# Altium project PanQuanXingProbj.PrjPCB
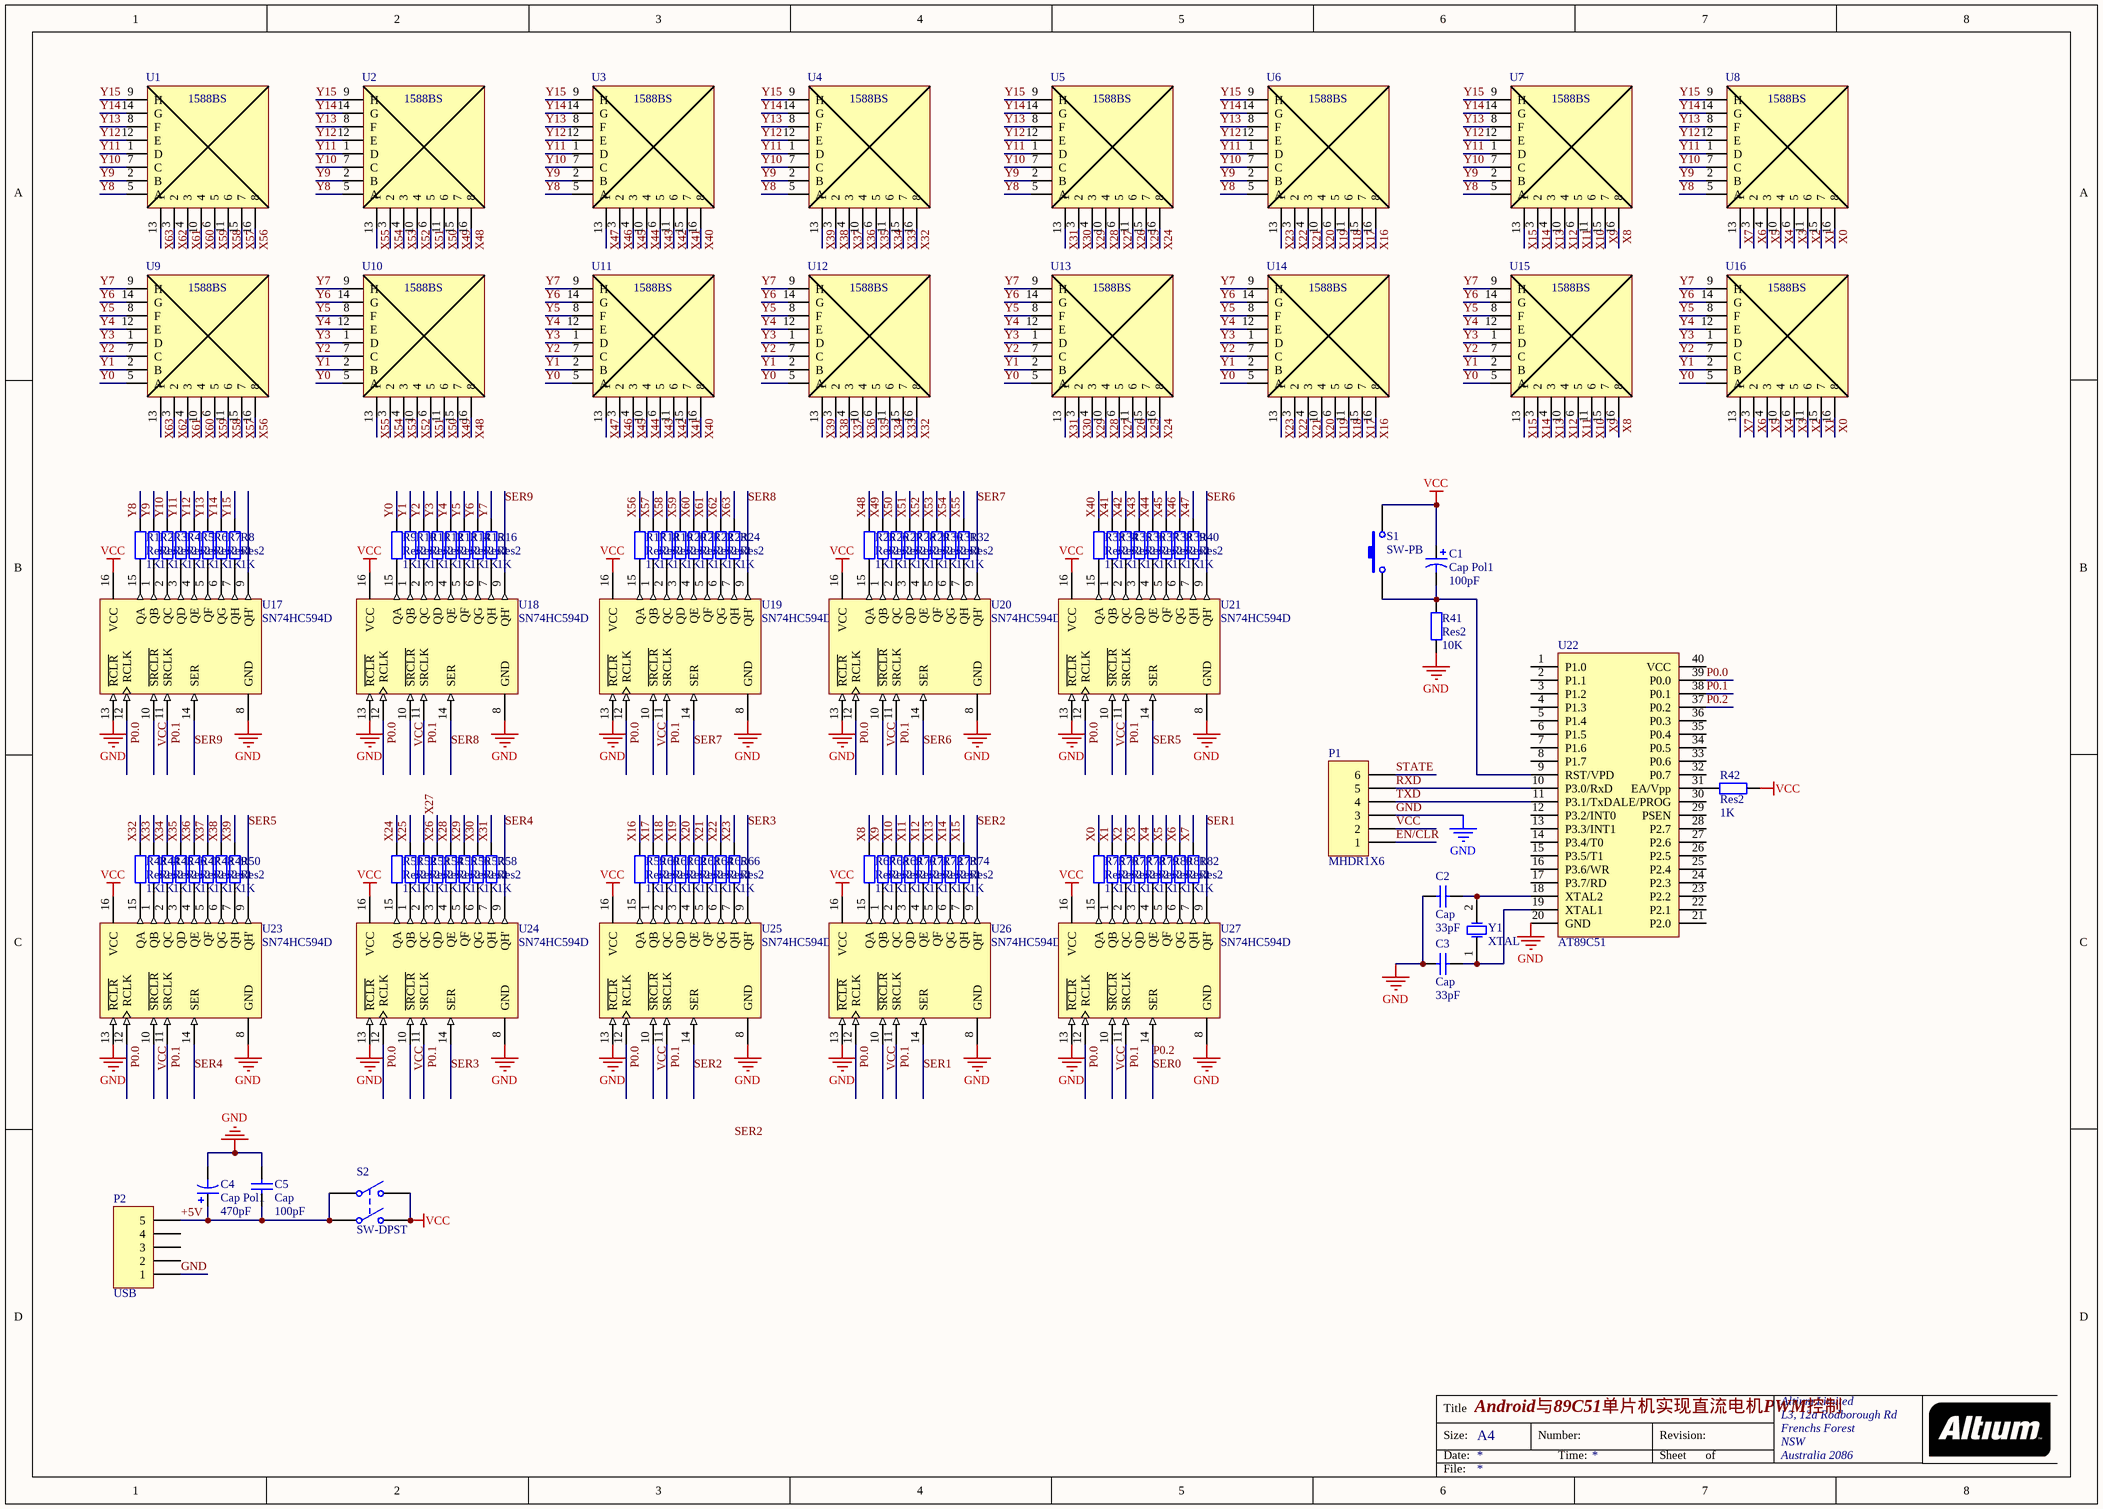
[diagram p0: pqxProbjSheet.SchDoc]
1 sheet, 119 parts. Net scope: global (net labels, ports and power ports of the same name join across sheets).
Board file: pqxSheetPCB.PcbDoc

## Sheet pqxProbjSheet.SchDoc: Android与89C51单片机实现直流电机PWM控制
size A3; Organization: Altium Limited; Address1: L3, 12a Rodborough Rd; Address2: Frenchs Forest; Address3: NSW; Address4: Australia 2086

### Parts
C1  Cap Pol1  value 100pF  [RB7.6-15]
C2  Cap  value 33pF  [RAD-0.3]
C3  Cap  value 33pF  [RAD-0.3]
C4  Cap Pol1  value 470pF  [RB7.6-15]
C5  Cap  value 100pF  [VP32-3.2]
P1  MHDR1X6  [MHDR1X6]
P2  USB  [HDR1X5]
R1  Res2  value 1K  [AXIAL-0.4]
R2  Res2  value 1K  [AXIAL-0.4]
R3  Res2  value 1K  [AXIAL-0.4]
R4  Res2  value 1K  [AXIAL-0.4]
R5  Res2  value 1K  [AXIAL-0.4]
R6  Res2  value 1K  [AXIAL-0.4]
R7  Res2  value 1K  [AXIAL-0.4]
R8  Res2  value 1K  [AXIAL-0.4]
R9  Res2  value 1K  [AXIAL-0.4]
R10  Res2  value 1K  [AXIAL-0.4]
R11  Res2  value 1K  [AXIAL-0.4]
R12  Res2  value 1K  [AXIAL-0.4]
R13  Res2  value 1K  [AXIAL-0.4]
R14  Res2  value 1K  [AXIAL-0.4]
R15  Res2  value 1K  [AXIAL-0.4]
R16  Res2  value 1K  [AXIAL-0.4]
R17  Res2  value 1K  [AXIAL-0.4]
R18  Res2  value 1K  [AXIAL-0.4]
R19  Res2  value 1K  [AXIAL-0.4]
R20  Res2  value 1K  [AXIAL-0.4]
R21  Res2  value 1K  [AXIAL-0.4]
R22  Res2  value 1K  [AXIAL-0.4]
R23  Res2  value 1K  [AXIAL-0.4]
R24  Res2  value 1K  [AXIAL-0.4]
R25  Res2  value 1K  [AXIAL-0.4]
R26  Res2  value 1K  [AXIAL-0.4]
R27  Res2  value 1K  [AXIAL-0.4]
R28  Res2  value 1K  [AXIAL-0.4]
R29  Res2  value 1K  [AXIAL-0.4]
R30  Res2  value 1K  [AXIAL-0.4]
R31  Res2  value 1K  [AXIAL-0.4]
R32  Res2  value 1K  [AXIAL-0.4]
R33  Res2  value 1K  [AXIAL-0.4]
R34  Res2  value 1K  [AXIAL-0.4]
R35  Res2  value 1K  [AXIAL-0.4]
R36  Res2  value 1K  [AXIAL-0.4]
R37  Res2  value 1K  [AXIAL-0.4]
R38  Res2  value 1K  [AXIAL-0.4]
R39  Res2  value 1K  [AXIAL-0.4]
R40  Res2  value 1K  [AXIAL-0.4]
R41  Res2  value 10K  [AXIAL-0.4]
R42  Res2  value 1K  [AXIAL-0.4]
R43  Res2  value 1K  [AXIAL-0.4]
R44  Res2  value 1K  [AXIAL-0.4]
R45  Res2  value 1K  [AXIAL-0.4]
R46  Res2  value 1K  [AXIAL-0.4]
R47  Res2  value 1K  [AXIAL-0.4]
R48  Res2  value 1K  [AXIAL-0.4]
R49  Res2  value 1K  [AXIAL-0.4]
R50  Res2  value 1K  [AXIAL-0.4]
R51  Res2  value 1K  [AXIAL-0.4]
R52  Res2  value 1K  [AXIAL-0.4]
R53  Res2  value 1K  [AXIAL-0.4]
R54  Res2  value 1K  [AXIAL-0.4]
R55  Res2  value 1K  [AXIAL-0.4]
R56  Res2  value 1K  [AXIAL-0.4]
R57  Res2  value 1K  [AXIAL-0.4]
R58  Res2  value 1K  [AXIAL-0.4]
R59  Res2  value 1K  [AXIAL-0.4]
R60  Res2  value 1K  [AXIAL-0.4]
R61  Res2  value 1K  [AXIAL-0.4]
R62  Res2  value 1K  [AXIAL-0.4]
R63  Res2  value 1K  [AXIAL-0.4]
R64  Res2  value 1K  [AXIAL-0.4]
R65  Res2  value 1K  [AXIAL-0.4]
R66  Res2  value 1K  [AXIAL-0.4]
R67  Res2  value 1K  [AXIAL-0.4]
R68  Res2  value 1K  [AXIAL-0.4]
R69  Res2  value 1K  [AXIAL-0.4]
R70  Res2  value 1K  [AXIAL-0.4]
R71  Res2  value 1K  [AXIAL-0.4]
R72  Res2  value 1K  [AXIAL-0.4]
R73  Res2  value 1K  [AXIAL-0.4]
R74  Res2  value 1K  [AXIAL-0.4]
R75  Res2  value 1K  [AXIAL-0.4]
R76  Res2  value 1K  [AXIAL-0.4]
R77  Res2  value 1K  [AXIAL-0.4]
R78  Res2  value 1K  [AXIAL-0.4]
R79  Res2  value 1K  [AXIAL-0.4]
R80  Res2  value 1K  [AXIAL-0.4]
R81  Res2  value 1K  [AXIAL-0.4]
R82  Res2  value 1K  [AXIAL-0.4]
S1  SW-PB  [SPST-2]
S2  SW-DPST  [DPST-4]
U1  1588BS  [1588BS_16Pin]
U2  1588BS  [1588BS_16Pin]
U3  1588BS  [1588BS_16Pin]
U4  1588BS  [1588BS_16Pin]
U5  1588BS  [1588BS_16Pin]
U6  1588BS  [1588BS_16Pin]
U7  1588BS  [1588BS_16Pin]
U8  1588BS  [1588BS_16Pin]
U9  1588BS  [1588BS_16Pin]
U10  1588BS  [1588BS_16Pin]
U11  1588BS  [1588BS_16Pin]
U12  1588BS  [1588BS_16Pin]
U13  1588BS  [1588BS_16Pin]
U14  1588BS  [1588BS_16Pin]
U15  1588BS  [1588BS_16Pin]
U16  1588BS  [1588BS_16Pin]
U17  SN74HC594D  [D016_N]
U18  SN74HC594D  [D016_N]
U19  SN74HC594D  [D016_N]
U20  SN74HC594D  [D016_N]
U21  SN74HC594D  [D016_N]
U22  AT89C51  [DIP40]
U23  SN74HC594D  [D016_N]
U24  SN74HC594D  [D016_N]
U25  SN74HC594D  [D016_N]
U26  SN74HC594D  [D016_N]
U27  SN74HC594D  [D016_N]
Y1  XTAL  [R38]

### Nets
GND: C2.1 C3.1 C4.2 C5.2 P1.3 P2.1 R41.1 U17.8(GND) U17.13(~{RCLR}) U18.8(GND) U18.13(~{RCLR}) U19.8(GND) U19.13(~{RCLR}) U20.8(GND) U20.13(~{RCLR}) U21.8(GND) U21.13(~{RCLR}) U22.20(GND) U23.8(GND) U23.13(~{RCLR}) U24.8(GND) U24.13(~{RCLR}) U25.8(GND) U25.13(~{RCLR}) U26.8(GND) U26.13(~{RCLR}) U27.8(GND) U27.13(~{RCLR})
VCC: C1.1 P1.2 R42.1 S1.2 S2.2(NO1) S2.4(NO2) U17.10(~{SRCLR}) U17.16(VCC) U18.10(~{SRCLR}) U18.16(VCC) U19.10(~{SRCLR}) U19.16(VCC) U20.10(~{SRCLR}) U20.16(VCC) U21.10(~{SRCLR}) U21.16(VCC) U23.10(~{SRCLR}) U23.16(VCC) U24.10(~{SRCLR}) U24.16(VCC) U25.10(~{SRCLR}) U25.16(VCC) U26.10(~{SRCLR}) U26.16(VCC) U27.10(~{SRCLR}) U27.16(VCC)
+5V: C4.1 C5.1 P2.5 S2.1(COMMON1) S2.3(COMMON2)
EN/CLR: P1.1
P0.0: U17.12(RCLK) U18.12(RCLK) U19.12(RCLK) U20.12(RCLK) U21.12(RCLK) U22.39(P0.0) U23.12(RCLK) U24.12(RCLK) U25.12(RCLK) U26.12(RCLK) U27.12(RCLK)
P0.1: U17.11(SRCLK) U18.11(SRCLK) U19.11(SRCLK) U20.11(SRCLK) U21.11(SRCLK) U22.38(P0.1) U23.11(SRCLK) U24.11(SRCLK) U25.11(SRCLK) U26.11(SRCLK) U27.11(SRCLK)
P0.2: U22.37(P0.2) U27.14(SER)  [also labelled SER0]
RXD: P1.5 U22.10(P3.0/RxD)
SER1: U26.14(SER) U27.9(QH')
SER2: U25.14(SER) U26.9(QH')
SER3: U24.14(SER) U25.9(QH')
SER4: U23.14(SER) U24.9(QH')
SER5: U21.14(SER) U23.9(QH')
SER6: U20.14(SER) U21.9(QH')
SER7: U19.14(SER) U20.9(QH')
SER8: U18.14(SER) U19.9(QH')
SER9: U17.14(SER) U18.9(QH')
STATE: P1.6
TXD: P1.4 U22.11(P3.1/TxD)
X0: R75.2 U8.16(8) U16.16(8)
X1: R76.2 U8.15(7) U16.15(7)
X2: R77.2 U8.11(6) U16.11(6)
X3: R78.2 U8.6(5) U16.6(5)
X4: R79.2 U8.10(4) U16.10(4)
X5: R80.2 U8.4(3) U16.4(3)
X6: R81.2 U8.3(2) U16.3(2)
X7: R82.2 U8.13(1) U16.13(1)
X8: R67.2 U7.16(8) U15.16(8)
X9: R68.2 U7.15(7) U15.15(7)
X10: R69.2 U7.11(6) U15.11(6)
X11: R70.2 U7.6(5) U15.6(5)
X12: R71.2 U7.10(4) U15.10(4)
X13: R72.2 U7.4(3) U15.4(3)
X14: R73.2 U7.3(2) U15.3(2)
X15: R74.2 U7.13(1) U15.13(1)
X16: R59.2 U6.16(8) U14.16(8)
X17: R60.2 U6.15(7) U14.15(7)
X18: R61.2 U6.11(6) U14.11(6)
X19: R62.2 U6.6(5) U14.6(5)
X20: R63.2 U6.10(4) U14.10(4)
X21: R64.2 U6.4(3) U14.4(3)
X22: R65.2 U6.3(2) U14.3(2)
X23: R66.2 U6.13(1) U14.13(1)
X24: R51.2 U5.16(8) U13.16(8)
X25: R52.2 U5.15(7) U13.15(7)
X26: R54.2 U5.6(5) U5.11(6) U13.6(5) U13.11(6)  [also labelled X27]
X28: R55.2 U5.10(4) U13.10(4)
X29: R56.2 U5.4(3) U13.4(3)
X30: R57.2 U5.3(2) U13.3(2)
X31: R58.2 U5.13(1) U13.13(1)
X32: R43.2 U4.16(8) U12.16(8)
X33: R44.2 U4.15(7) U12.15(7)
X34: R45.2 U4.11(6) U12.11(6)
X35: R46.2 U4.6(5) U12.6(5)
X36: R47.2 U4.10(4) U12.10(4)
X37: R48.2 U4.4(3) U12.4(3)
X38: R49.2 U4.3(2) U12.3(2)
X39: R50.2 U4.13(1) U12.13(1)
X40: R33.2 U3.16(8) U11.16(8)
X41: R34.2 U3.15(7) U11.15(7)
X42: R35.2 U3.11(6) U11.11(6)
X43: R36.2 U3.6(5) U11.6(5)
X44: R37.2 U3.10(4) U11.10(4)
X45: R38.2 U3.4(3) U11.4(3)
X46: R39.2 U3.3(2) U11.3(2)
X47: R40.2 U3.13(1) U11.13(1)
X48: R25.2 U2.16(8) U10.16(8)
X49: R26.2 U2.15(7) U10.15(7)
X50: R27.2 U2.11(6) U10.11(6)
X51: R28.2 U2.6(5) U10.6(5)
X52: R29.2 U2.10(4) U10.10(4)
X53: R30.2 U2.4(3) U10.4(3)
X54: R31.2 U2.3(2) U10.3(2)
X55: R32.2 U2.13(1) U10.13(1)
X56: R17.2 U1.16(8) U9.16(8)
X57: R18.2 U1.15(7) U9.15(7)
X58: R19.2 U1.11(6) U9.11(6)
X59: R20.2 U1.6(5) U9.6(5)
X60: R21.2 U1.10(4) U9.10(4)
X61: R22.2 U1.4(3) U9.4(3)
X62: R23.2 U1.3(2) U9.3(2)
X63: R24.2 U1.13(1) U9.13(1)
Y0: R9.2 U9.5(A) U10.5(A) U11.5(A) U12.5(A) U13.5(A) U14.5(A) U15.5(A) U16.5(A)
Y1: R10.2 U9.2(B) U10.2(B) U11.2(B) U12.2(B) U13.2(B) U14.2(B) U15.2(B) U16.2(B)
Y2: R11.2 U9.7(C) U10.7(C) U11.7(C) U12.7(C) U13.7(C) U14.7(C) U15.7(C) U16.7(C)
Y3: R12.2 U9.1(D) U10.1(D) U11.1(D) U12.1(D) U13.1(D) U14.1(D) U15.1(D) U16.1(D)
Y4: R13.2 U9.12(E) U10.12(E) U11.12(E) U12.12(E) U13.12(E) U14.12(E) U15.12(E) U16.12(E)
Y5: R14.2 U9.8(F) U10.8(F) U11.8(F) U12.8(F) U13.8(F) U14.8(F) U15.8(F) U16.8(F)
Y6: R15.2 U9.14(G) U10.14(G) U11.14(G) U12.14(G) U13.14(G) U14.14(G) U15.14(G) U16.14(G)
Y7: R16.2 U9.9(H) U10.9(H) U11.9(H) U12.9(H) U13.9(H) U14.9(H) U15.9(H) U16.9(H)
Y8: R1.2 U1.5(A) U2.5(A) U3.5(A) U4.5(A) U5.5(A) U6.5(A) U7.5(A) U8.5(A)
Y9: R2.2 U1.2(B) U2.2(B) U3.2(B) U4.2(B) U5.2(B) U6.2(B) U7.2(B) U8.2(B)
Y10: R3.2 U1.7(C) U2.7(C) U3.7(C) U4.7(C) U5.7(C) U6.7(C) U7.7(C) U8.7(C)
Y11: R4.2 U1.1(D) U2.1(D) U3.1(D) U4.1(D) U5.1(D) U6.1(D) U7.1(D) U8.1(D)
Y12: R5.2 U1.12(E) U2.12(E) U3.12(E) U4.12(E) U5.12(E) U6.12(E) U7.12(E) U8.12(E)
Y13: R6.2 U1.8(F) U2.8(F) U3.8(F) U4.8(F) U5.8(F) U6.8(F) U7.8(F) U8.8(F)
Y14: R7.2 U1.14(G) U2.14(G) U3.14(G) U4.14(G) U5.14(G) U6.14(G) U7.14(G) U8.14(G)
Y15: R8.2 U1.9(H) U2.9(H) U3.9(H) U4.9(H) U5.9(H) U6.9(H) U7.9(H) U8.9(H)
NetC1_2: C1.2 R41.2 S1.1 U22.9(RST/VPD)
NetC2_2: C2.2 U22.18(XTAL2) Y1.2(OSC2)
NetC3_2: C3.2 U22.19(XTAL1) Y1.1(OSC1)
NetR1_1: R1.1 U17.15(QA)
NetR2_1: R2.1 U17.1(QB)
NetR3_1: R3.1 U17.2(QC)
NetR4_1: R4.1 U17.3(QD)
NetR5_1: R5.1 U17.4(QE)
NetR6_1: R6.1 U17.5(QF)
NetR7_1: R7.1 U17.6(QG)
NetR8_1: R8.1 U17.7(QH)
NetR9_1: R9.1 U18.15(QA)
NetR10_1: R10.1 U18.1(QB)
NetR11_1: R11.1 U18.2(QC)
NetR12_1: R12.1 U18.3(QD)
NetR13_1: R13.1 U18.4(QE)
NetR14_1: R14.1 U18.5(QF)
NetR15_1: R15.1 U18.6(QG)
NetR16_1: R16.1 U18.7(QH)
NetR17_1: R17.1 U19.15(QA)
NetR18_1: R18.1 U19.1(QB)
NetR19_1: R19.1 U19.2(QC)
NetR20_1: R20.1 U19.3(QD)
NetR21_1: R21.1 U19.4(QE)
NetR22_1: R22.1 U19.5(QF)
NetR23_1: R23.1 U19.6(QG)
NetR24_1: R24.1 U19.7(QH)
NetR25_1: R25.1 U20.15(QA)
NetR26_1: R26.1 U20.1(QB)
NetR27_1: R27.1 U20.2(QC)
NetR28_1: R28.1 U20.3(QD)
NetR29_1: R29.1 U20.4(QE)
NetR30_1: R30.1 U20.5(QF)
NetR31_1: R31.1 U20.6(QG)
NetR32_1: R32.1 U20.7(QH)
NetR33_1: R33.1 U21.15(QA)
NetR34_1: R34.1 U21.1(QB)
NetR35_1: R35.1 U21.2(QC)
NetR36_1: R36.1 U21.3(QD)
NetR37_1: R37.1 U21.4(QE)
NetR38_1: R38.1 U21.5(QF)
NetR39_1: R39.1 U21.6(QG)
NetR40_1: R40.1 U21.7(QH)
NetR42_2: R42.2 U22.31(EA/Vpp)
NetR43_1: R43.1 U23.15(QA)
NetR44_1: R44.1 U23.1(QB)
NetR45_1: R45.1 U23.2(QC)
NetR46_1: R46.1 U23.3(QD)
NetR47_1: R47.1 U23.4(QE)
NetR48_1: R48.1 U23.5(QF)
NetR49_1: R49.1 U23.6(QG)
NetR50_1: R50.1 U23.7(QH)
NetR51_1: R51.1 U24.15(QA)
NetR52_1: R52.1 U24.1(QB)
NetR53_1: R53.1 U24.2(QC)
NetR54_1: R54.1 U24.3(QD)
NetR55_1: R55.1 U24.4(QE)
NetR56_1: R56.1 U24.5(QF)
NetR57_1: R57.1 U24.6(QG)
NetR58_1: R58.1 U24.7(QH)
NetR59_1: R59.1 U25.15(QA)
NetR60_1: R60.1 U25.1(QB)
NetR61_1: R61.1 U25.2(QC)
NetR62_1: R62.1 U25.3(QD)
NetR63_1: R63.1 U25.4(QE)
NetR64_1: R64.1 U25.5(QF)
NetR65_1: R65.1 U25.6(QG)
NetR66_1: R66.1 U25.7(QH)
NetR67_1: R67.1 U26.15(QA)
NetR68_1: R68.1 U26.1(QB)
NetR69_1: R69.1 U26.2(QC)
NetR70_1: R70.1 U26.3(QD)
NetR71_1: R71.1 U26.4(QE)
NetR72_1: R72.1 U26.5(QF)
NetR73_1: R73.1 U26.6(QG)
NetR74_1: R74.1 U26.7(QH)
NetR75_1: R75.1 U27.15(QA)
NetR76_1: R76.1 U27.1(QB)
NetR77_1: R77.1 U27.2(QC)
NetR78_1: R78.1 U27.3(QD)
NetR79_1: R79.1 U27.4(QE)
NetR80_1: R80.1 U27.5(QF)
NetR81_1: R81.1 U27.6(QG)
NetR82_1: R82.1 U27.7(QH)

Not connected (* = marked no-connect by the designer): P2 2 3 4; R53 2; U17 9(QH'); U22 1(P1.0) 2(P1.1) 3(P1.2) 4(P1.3) 5(P1.4) 6(P1.5) 7(P1.6) 8(P1.7) 12(P3.2/INT0) 13(P3.3/INT1) 14(P3.4/T0) 15(P3.5/T1) 16(P3.6/WR) 17(P3.7/RD) 21(P2.0) 22(P2.1) 23(P2.2) 24(P2.3) 25(P2.4) 26(P2.5) 27(P2.6) 28(P2.7) 29(PSEN) 30(ALE/PROG) 32(P0.7) 33(P0.6) 34(P0.5) 35(P0.4) 36(P0.3) 40(VCC)

### Notes on the sheet
- Title
- Size:
- Date:
- A4
- Number:
- Time:
- Revision:
- Sheet
- of
- File:
- Labels drawn without touching a wire or pin: SER2

### Library data of the parts
C1 C4 = Cap Pol1: Polarized Capacitor (Radial); Published: 8-Jun-2000; LatestRevisionDate: 17-Jul-2002; LatestRevisionNote: Re-released for DXP Platform.; PackageReference: RB7.6-15; Publisher: Altium Limited
C2 C3 C5 = Cap: Capacitor; Published: 8-Jun-2000; LatestRevisionDate: 17-Jul-2002; LatestRevisionNote: Re-released for DXP Platform.; PackageReference: RAD-0.3; Publisher: Altium Limited
P1 = MHDR1X6: Header, 6-Pin; LatestRevisionDate: 17-Jul-2002; LatestRevisionNote: Re-released for DXP Platform.; Publisher: Altium Limited
P2 = Header 5H: Header, 5-Pin, Right Angle; LatestRevisionDate: 17-Jul-2002; LatestRevisionNote: Re-released for DXP Platform.; Publisher: Altium Limited
R1-R82 = Res2: Resistor; Published: 8-Jun-2000; LatestRevisionDate: 17-Jul-2002; LatestRevisionNote: Re-released for DXP Platform.; PackageReference: AXIAL-0.4; Publisher: Altium Limited
S1 = SW-PB: Switch; Published: 24-Mar-1999; LatestRevisionDate: 17-Jul-2002; LatestRevisionNote: Re-released for DXP Platform.; PackageReference: SPST-2; Publisher: Altium Limited
S2 = SW-DPST: Double-Pole, Single-Throw Switch; Published: 24-Mar-1999; LatestRevisionDate: 17-Jul-2002; LatestRevisionNote: Re-released for DXP Platform.; PackageReference: DPST-4; Publisher: Altium Limited
U1-U16 = 1588BS点阵: 1588BS: RAD
U17-U21 U23-U27 = SN74HC594D: 8-Bit Shift Register with Output Registers; Published: 8-Jun-2000; LatestRevisionDate: 13-Apr-2006; LatestRevisionNote: IPC-7351 Footprint Added.; DatasheetVersion: Feb-1998; PackageVersion: Jan-1998; PackageReference: D016; Publisher: Altium Limited; PackageDescription: 16-Pin Small Outline Integrated Circuit 1.27 mm Pitch; Code_IPC: SOIC127P600-16; ComponentLink1Description: Manufacturer Link; ComponentLink1URL: http://www.ti.com/; ComponentLink2Description: Datasheet; ComponentLink2URL: http://www-s.ti.com/sc/ds/sn74hc594.pdf
U22 = 89C51
Y1 = XTAL: Crystal Oscillator; Published: 8-Jun-2000; LatestRevisionDate: 17-Jul-2002; LatestRevisionNote: Re-released for DXP Platform.; PackageReference: R38; Publisher: Altium Limited